# EAGLE schematic Fichier Eagle Pour Le PCB (EAGLE 8.0.2)
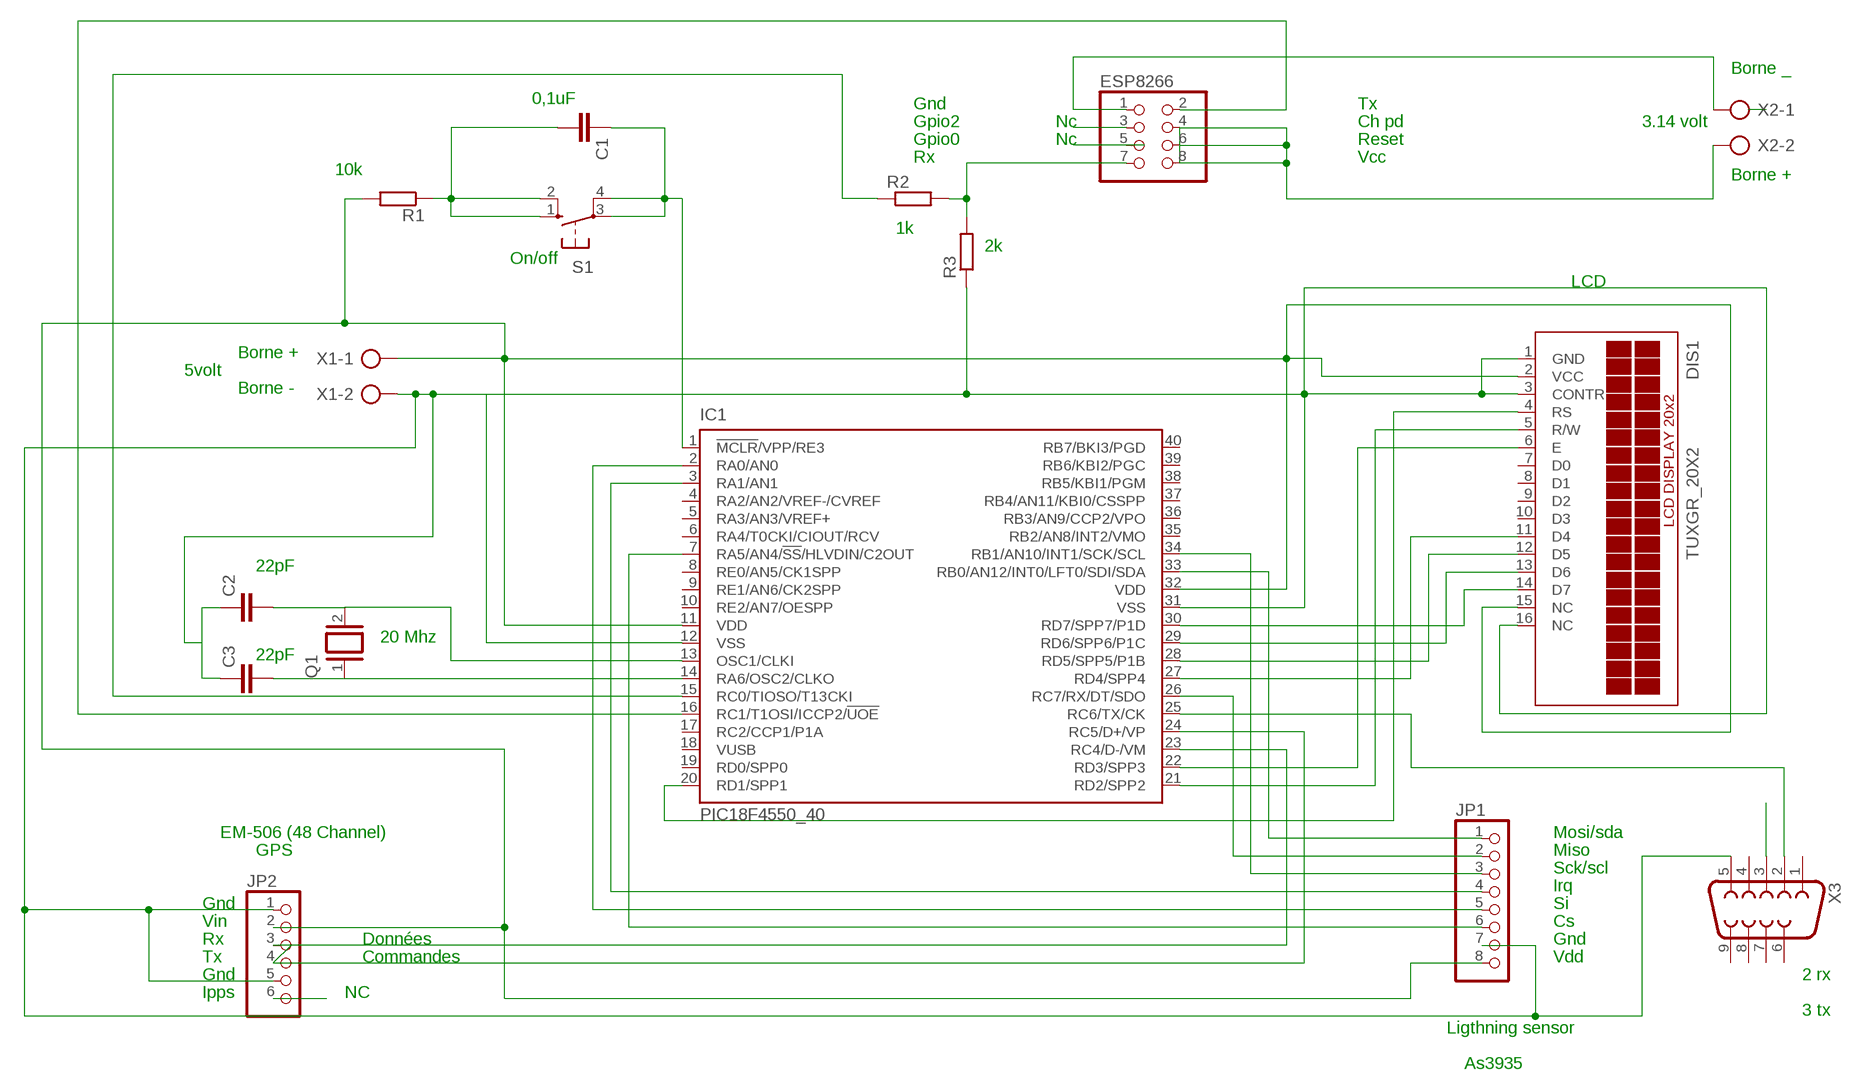
[diagram p0: schematic, sheet 1]

## Parts
C1  C-EU025-030X050  [C025-030X050]
C2  C-EU025-030X050  [C025-030X050]
C3  C-EU025-030X050  [C025-030X050]
DIS1  TUXGR_20X2  [TUXGR_20X2]
ESP8266  PINHD-2X4  [2X04]
IC1  PIC18F4550_40  [DIL40]
JP1  PINHD-1X8  [1X08]
JP2  PINHD-1X6  [1X06]
Q1  XTAL/S  [QS]
R1  R-EU_0207/10  [0207/10]
R2  R-EU_0207/10  [0207/10]
R3  R-EU_0207/10  [0207/10]
S1  10-XX  [B3F-10XX]
X1  AK300/2  [AK300/2]
X2  AK300/2  [AK300/2]
X3  F09VB  [F09VB]

## Nets
N$1: JP2.6
N$2: C1.2 R1.1 S1.1(S) S1.2(S1)
N$3: DIS1.14(D7) IC1.30(RD7/SPP7/P1D)
N$4: ESP8266.4 ESP8266.6 ESP8266.8 X2.2
N$5: IC1.33(RB0/AN12/INT0/LFT0/SDI/SDA) JP1.1
N$6: IC1.25(RC6/TX/CK) X3.2
N$7: IC1.26(RC7/RX/DT/SDO) JP1.2
N$8: IC1.34(RB1/AN10/INT1/SCK/SCL) JP1.3
N$9: DIS1.4(RS) IC1.20(RD1/SPP1)
N$10: ESP8266.7 R2.2 R3.2
N$11: IC1.3(RA1/AN1) JP1.4
N$12: C2.1 C3.1 DIS1.1(GND) DIS1.3(CONTR) DIS1.16(NC) IC1.12(VSS) IC1.31(VSS) JP1.7 JP2.1 JP2.5 R3.1 X1.2 X3.5
N$13: DIS1.5(R/W) IC1.21(RD2/SPP2)
N$14: ESP8266.1 X2.1
N$15: C1.1 IC1.1(!MCLR!/VPP/RE3) S1.3(P) S1.4(P1)
N$16: DIS1.11(D4) IC1.27(RD4/SPP4)
N$18: DIS1.6(E) IC1.22(RD3/SPP3)
N$20: C2.2 IC1.13(OSC1/CLKI) Q1.2
N$21: IC1.15(RC0/TIOSO/T13CKI) R2.1
N$22: DIS1.2(VCC) DIS1.15(NC) IC1.11(VDD) IC1.32(VDD) JP1.8 JP2.2 R1.2 X1.1
N$23: X3.3
N$24: ESP8266.3
N$25: DIS1.13(D6) IC1.29(RD6/SPP6/P1C)
N$26: C3.2 IC1.14(RA6/OSC2/CLKO) Q1.1
N$28: IC1.2(RA0/AN0) JP1.5
N$29: DIS1.12(D5) IC1.28(RD5/SPP5/P1B)
N$30: IC1.7(RA5/AN4/!SS!/HLVDIN/C2OUT) JP1.6
N$31: IC1.23(RC4/D-/VM) JP2.3
N$33: IC1.24(RC5/D+/VP) JP2.4
N$37: ESP8266.2 IC1.16(RC1/T1OSI/ICCP2/!UOE)
Unconnected: DIS1.7(D0) DIS1.8(D1) DIS1.9(D2) DIS1.10(D3) ESP8266.5 IC1.4(RA2/AN2/VREF-/CVREF) IC1.5(RA3/AN3/VREF+) IC1.6(RA4/T0CKI/CIOUT/RCV) IC1.8(RE0/AN5/CK1SPP) IC1.9(RE1/AN6/CK2SPP) IC1.10(RE2/AN7/OESPP) IC1.17(RC2/CCP1/P1A) IC1.18(VUSB) IC1.19(RD0/SPP0) IC1.35(RB2/AN8/INT2/VMO) IC1.36(RB3/AN9/CCP2/VPO) IC1.37(RB4/AN11/KBI0/CSSPP) IC1.38(RB5/KBI1/PGM) IC1.39(RB6/KBI2/PGC) IC1.40(RB7/BKI3/PGD) X3.1 X3.4 X3.6 X3.7 X3.8 X3.9

## Notes on the sheet
- Borne _
- 0,1uF
- Gnd | Tx
- Gpio2 | Nc | Ch pd | 3.14 volt
- Gpio0 | Nc | Reset
- 10k | Rx | Vcc
- Borne +
- 1k
- On/off | 2k
- LCD
- Borne +
- 5volt
- Borne -
- 22pF
- 20 Mhz
- 22pF
- EM-506 (48 Channel) | Mosi/sda
- GPS | Miso
- Sck/scl
- Irq
- Gnd | Si
- Vin | Cs
- Rx | Données | Gnd
- Tx | Commandes | Vdd
- Gnd | 2 rx
- Ipps | NC
- 3 tx
- Ligthning sensor
- As3935

## Library data of the parts
C1-C3 = resistor:C-EU: CAPACITOR, European symbol
DIS1 = display-lcd:TUXGR_20X2: Tuxgraphics LCD display 20x2 characters reflective, without background light Source: tuxgr_20x2.pdf; OC_FARNELL: unknown; OC_NEWARK: unknown
ESP8266 = pinhead:PINHD-2X4: PIN HEADER
IC1 = microchip:PIC18F4*_40: USB Microcontrollers with nanoWatt Technology High-Performance, Enhanced Flash, 28/40/44-Pin, Source: http://ww1.microchip.com/downloads/en/devicedoc/39632c.pdf; MF: MICROCHIP; MPN: PIC18F4550-I/P; OC_FARNELL: 9321357; OC_NEWARK: 74K8623
JP1 = pinhead:PINHD-1X8: PIN HEADER
JP2 = pinhead:PINHD-1X6: PIN HEADER
Q1 = special:XTAL/S: CRYSTAL
R1-R3 = resistor:R-EU_: RESISTOR, European symbol
S1 = switch-omron:10-XX: OMRON SWITCH; MPN: B3F-1000; OC_FARNELL: 176432; OC_NEWARK: 36M3542
X1 X2 = con-ptr500:AK300/2: CONNECTOR; OC_FARNELL: unknown; OC_NEWARK: unknown
X3 = con-subd:F09: SUB-D; OC_FARNELL: unknown; OC_NEWARK: unknown